# Altium schematic sheet CW340_HEATSINK_FAN.SchDoc: FAN Headers
size Letter; Organization: NewAE Technology Inc.; Address1: 1083 Queen St., Suite 196; Address2: Halifax; Address3: NS; Address4: Canada B3H 0B2; DocumentNumber: .; Revision: .; SheetNumber: 31; SheetTotal: 31; SheetApproved: Yes
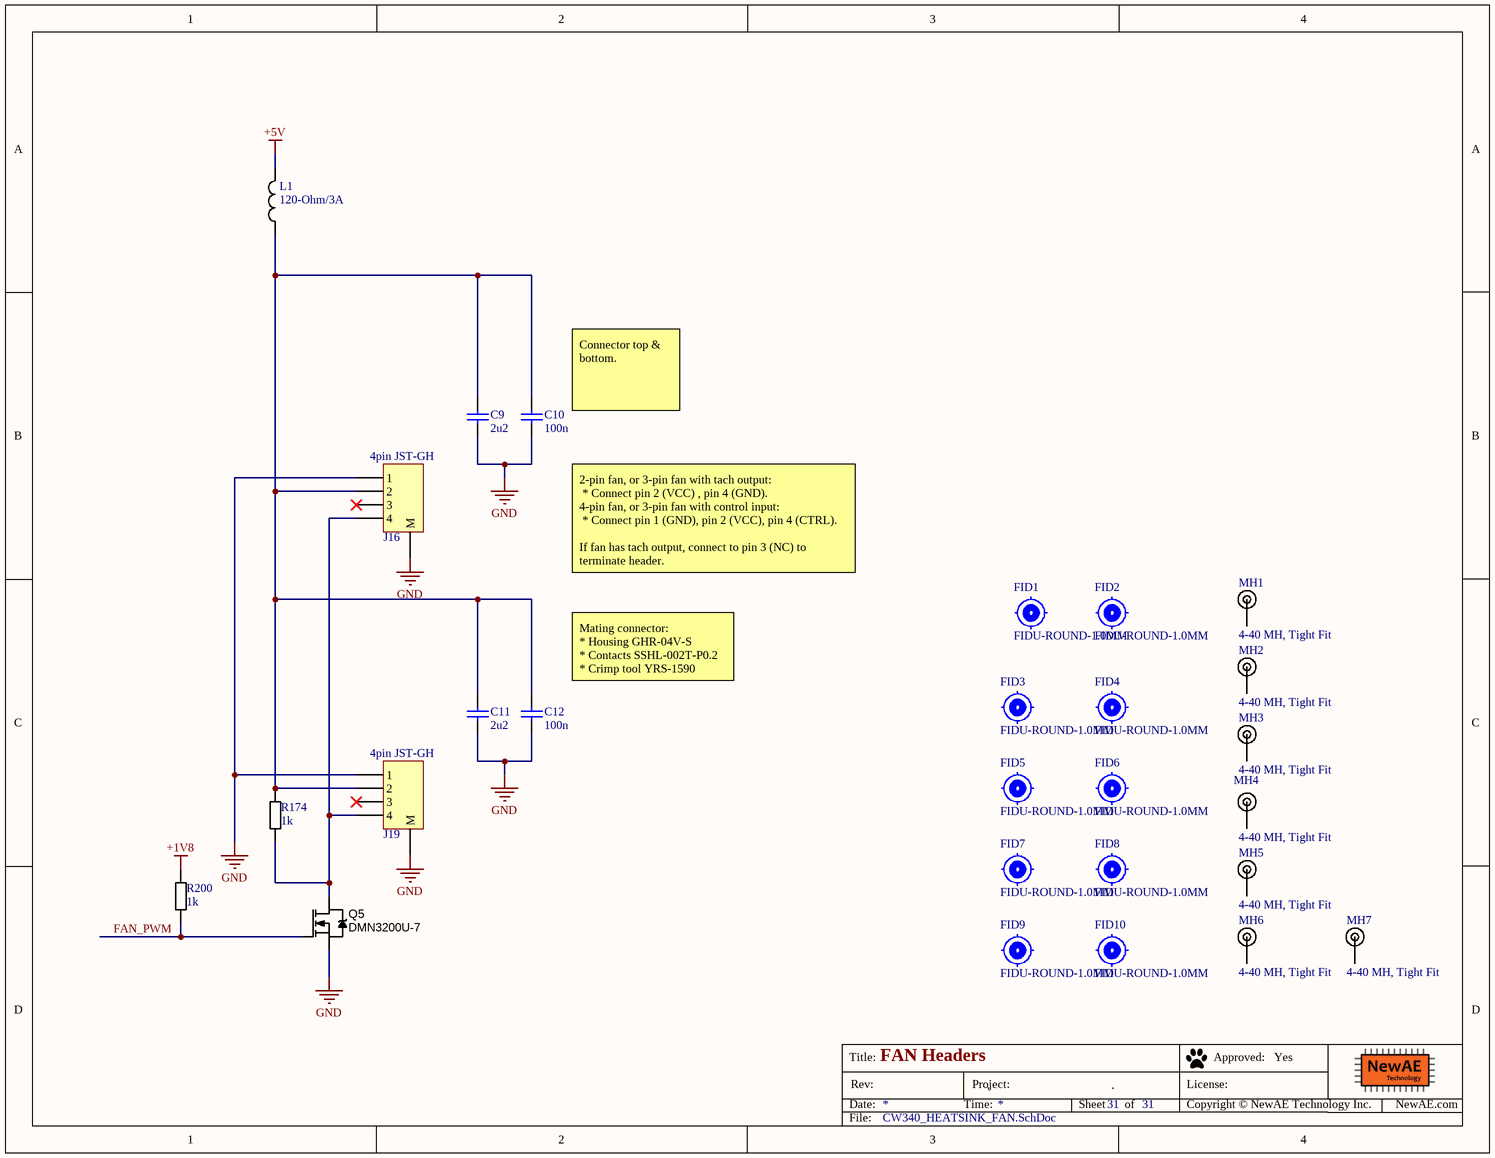
[diagram p0: CW340_HEATSINK_FAN.SchDoc]

## Parts
C9  2u2  [CAPC0603_M]
C10  100n  [CAPC0402_M]
C11  2u2  [CAPC0603_M]
C12  100n  [CAPC0402_M]
FID1  FIDU-ROUND-1.0MM  [FIDU-ROUND-1.0mm]  (no BOM)
FID2  FIDU-ROUND-1.0MM  [FIDU-ROUND-1.0mm]  (no BOM)
FID3  FIDU-ROUND-1.0MM  [FIDU-ROUND-1.0mm]  (no BOM)
FID4  FIDU-ROUND-1.0MM  [FIDU-ROUND-1.0mm]  (no BOM)
FID5  FIDU-ROUND-1.0MM  [FIDU-ROUND-1.0mm]  (no BOM)
FID6  FIDU-ROUND-1.0MM  [FIDU-ROUND-1.0mm]  (no BOM)
FID7  FIDU-ROUND-1.0MM  [FIDU-ROUND-1.0mm]  (no BOM)
FID8  FIDU-ROUND-1.0MM  [FIDU-ROUND-1.0mm]  (no BOM)
FID9  FIDU-ROUND-1.0MM  [FIDU-ROUND-1.0mm]  (no BOM)
FID10  FIDU-ROUND-1.0MM  [FIDU-ROUND-1.0mm]  (no BOM)
J16  4pin JST-GH  [BM04B-GHS-TBT]
J19  4pin JST-GH  [BM04B-GHS-TBT]
L1  120-Ohm/3A  [IND_0603]
MH1  4-40 MH, Tight Fit  [MOUNT_#4_TIGHT]
MH2  4-40 MH, Tight Fit  [MOUNT_#4_TIGHT]
MH3  4-40 MH, Tight Fit  [MOUNT_#4_TIGHT]
MH4  4-40 MH, Tight Fit  [MOUNT_#4_TIGHT]
MH5  4-40 MH, Tight Fit  [MOUNT_#4_TIGHT]
MH6  4-40 MH, Tight Fit  [MOUNT_#4_TIGHT]
MH7  4-40 MH, Tight Fit  [MOUNT_#4_TIGHT]
Q5  DMN3200U-7  [SOT95P245X110-3M]
R174  1k  [RESC1005X40N]
R200  1k  [RESC1005X40N]

## Nets
+1V8: R200.1
+5V: L1.2
GND: C9.2 C10.2 C11.2 C12.2 J16.1 J16.M J19.1 J19.M Q5.2(S)
FAN_PWM: Q5.1(G) R200.2
NetC9_1: C9.1 C10.1 C11.1 C12.1 J16.2 J19.2 L1.1 R174.1
NetJ16_4: J16.4 J19.4 Q5.3(D) R174.2

Not connected (* = marked no-connect by the designer): J16 3*; J19 3*; MH1 1; MH2 1; MH3 1; MH4 1; MH5 1; MH6 1; MH7 1

## Notes on the sheet
- (near C10) Connector top & bottom.
- 2-pin fan, or 3-pin fan with tach output:
  * Connect pin 2 (VCC) , pin 4 (GND).
  4-pin fan, or 3-pin fan with control input:
  * Connect pin 1 (GND), pin 2 (VCC), pin 4 (CTRL).
  If fan has tach output, connect to pin 3 (NC) to terminate header.
- (near C12) Mating connector:
  * Housing GHR-04V-S
  * Contacts SSHL-002T-P0.2
  * Crimp tool YRS-1590
- Title:
- Date:
- Rev:
- Time:
- Project:
- Sheet
- of
- License:
- Copyright © NewAE Technology Inc.
- Approved:
- NewAE.com
- File:

## Library data of the parts
C9 C11 = CCHIP-2u2-0603: 2u2, 0603; Manufacture 1: Samsung; Manufacture Part Number 1: CL10B225KP8NNNC; Component Group: Capacitor; Case-EIA: 0603; Case-Metric: 1608; Rated Voltage: 10VDC; Part Number: CCHIP-2u2-0603; Footprint: 0603; Pin Count: 2; Supplier 1: Digi-Key; Supplier Part Number 1: 1276-1134-1-ND; Value: 2u2; Mounting Technology: SMT; Component Kind: Standard; Component Type: Standard
C10 C12 = CCHIP-100n-0402: 100n, 0402; Manufacture Part Number 1: CGA2B3X7R1V104K050BB; Component Group: Capacitor; Case-EIA: 0402; Part Number: CCHIP-100n-0402; Footprint: 0402; Pin Count: 2; Supplier 1: Digi-Key; Supplier Part Number 1: 445-6901-1-ND; Value: 100n; Mounting Technology: SMT; Component Kind: Standard; Component Type: Standard
FID1-FID10 = FIDU-ROUND-1.0MM: ROUND FIDUCIAL; Component Group: PCB Feature; Part Number: FIDU-ROUND-1.0MM; Pin Count: 0; Component Type: Standard (No BOM)
J16 J19 = BM04B-GHS-TBT: CONN HEADER SMD 4POS 1.25MM; Manufacture 1: JST Sales America Inc.; Manufacture Part Number 1: BM04B-GHS-TBT(LF)(SN)(N); Component Group: Connector; PP Material Stack: 0; Part Number: BM04B-GHS-TBT; Footprint: Nonstandard; Pin Count: 4; Supplier 1: Digi-Key; Supplier Part Number 1: 455-1580-1-ND; Mounting Technology: SMT; RoHS: Yes; Component Kind: Standard; Component Type: Standard; PP Rotation: 0
L1 = FBCHIP-120R-0603: 120 Ohm @ 100 MHz, 3A rated FB; Manufacture 1: Murata Electronics; Manufacture Part Number 1: BLM18SG121TN1D; Component Group: Inductor; Value: 120R/3A; Case-EIA: 0603; Case-Metric: 1680; PP Material Stack: 0; Part Number: FBCHIP-120R-0603; Footprint: 0603; Pin Count: 2; Supplier 1: Digi-Key; Supplier Part Number 1: 490-3996-1-ND; Rated Power: 3A; Component Kind: Standard; Component Type: Standard; PP Rotation: 0
MH1-MH7 = MOUNT_#4_TIGHT: Machine screw 4-40 Mounting Hole; Component Group: Mechanical; PP Material Stack: 0; Part Number: MOUNT_#4_TIGHT; Pin Count: 1; Component Kind: Mechanical; Component Type: Mechanical; PP Rotation: 0
Q5 = DMN3200U-7: MOSFET N-CH 30V 2.2A SOT23-3; Manufacture 1: Diodes Inc.; Rated Power: 3A; PP Material Stack: 0; Part Number: DMN3200U-7; Component Group: MOSFET; Footprint: SOT23; Manufacture Part Number 1: DMN3200U-7; Pin Count: 3; Supplier 1: Digi-Key; Supplier Part Number 1: DMN3200U-7DICT-ND; Rated Voltage: 30V; Mounting Technology: SMT; RoHS: Yes; Component Kind: Standard; Component Type: Standard; PP Rotation: 0
R174 R200 = RCHIP-1K-0402: 1k res, 0402, 1%, 1/16W; Manufacture 1: Yageo; Manufacture Part Number 1: RC0402FR-071KL; Component Group: Resistor; Case-EIA: 0402; Case-Metric: 1005; Rated Power: 0.063W; Rated Voltage: 75VDC; Part Number: RCHIP-1K-0402; Footprint: 0402; Pin Count: 2; Supplier 1: Digi-Key; Supplier Part Number 1: 311-1.00KLRCT-ND; Value: 1k; Tolerance: 1%; Mounting Technology: SMT; Temperature Range: -55C to 155C; Component Kind: Standard; Component Type: Standard